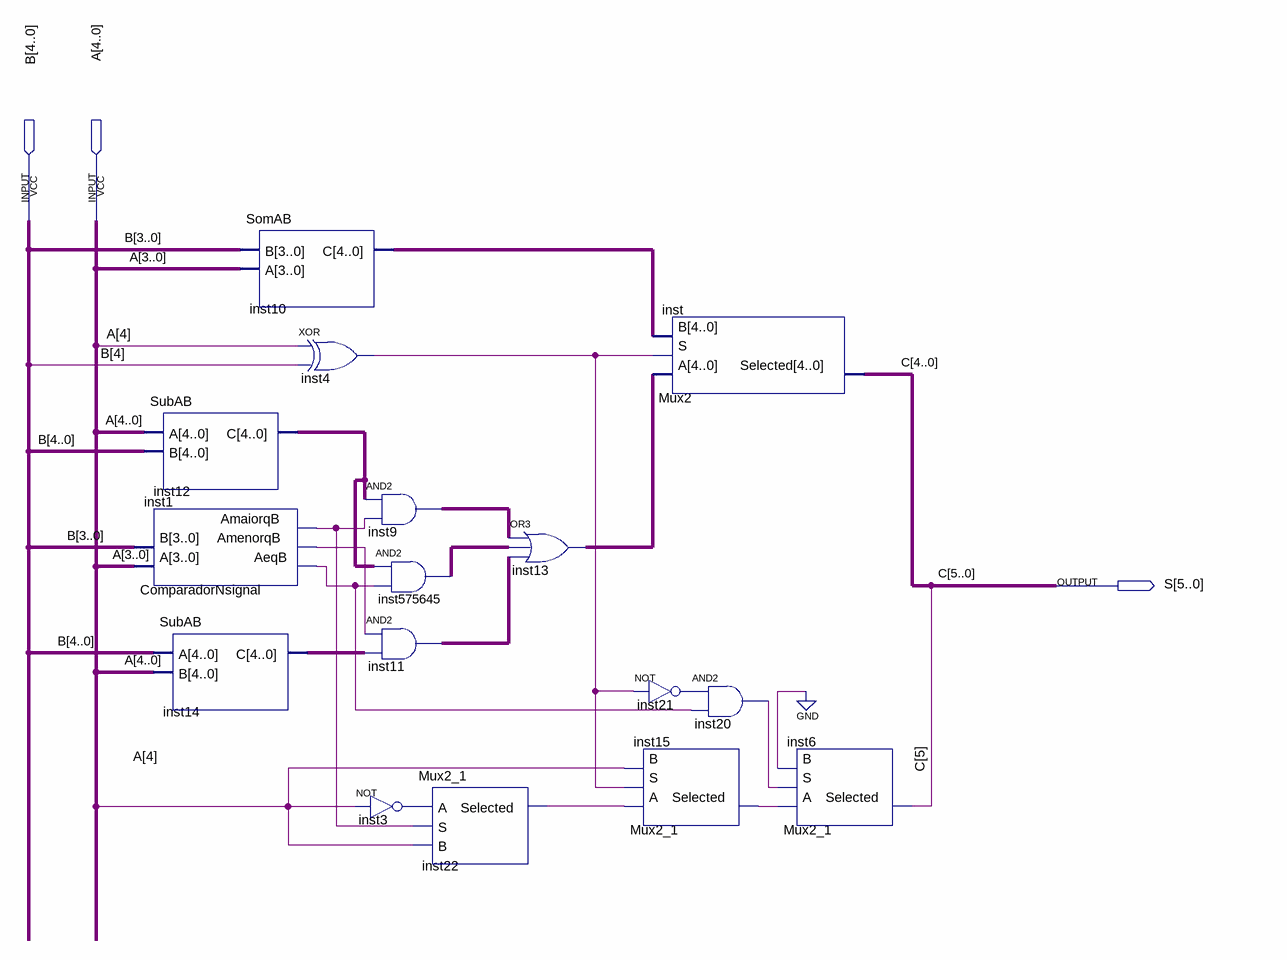
[diagram p0: schematic sheet]
// Quartus schematic Subtrator.bdf as structural Verilog: 16 symbols, 3 pins
module Subtrator (
  input  [4:0] B,
  input  [4:0] A,
  output [5:0] S
);

  wire inst1_aeqb, inst1_amaiorqb, inst1_amenorqb, inst3_out, inst4_out, inst15_selected, inst20_out,
       inst21_out, inst22_selected;
  wire [4:0] inst9_out, inst10_c, inst11_out, inst12_c, inst13_out, inst14_c, inst575645_out;

  ComparadorNsignal inst1 (
    .A(A[3:0]), .B(B[3:0]), .AeqB(inst1_aeqb), .AmenorqB(inst1_amenorqb), .AmaiorqB(inst1_amaiorqb));
  SubAB inst12 (.A(A), .B(B), .C(inst12_c));
  SubAB inst14 (.A(B), .B(A), .C(inst14_c));
  SomAB inst10 (.B(B[3:0]), .A(A[3:0]), .C(inst10_c));
  xor inst4 (inst4_out, A[4], B[4]);
  assign inst9_out = inst12_c & {5{inst1_amaiorqb}};  // AND2 inst9, 5 bits wide
  assign inst11_out = {5{inst1_amenorqb}} & inst14_c;  // AND2 inst11, 5 bits wide
  not inst3 (inst3_out, A[4]);
  assign inst575645_out = inst12_c & {5{inst1_aeqb}};  // AND2 inst575645, 5 bits wide
  Mux2_1 inst22 (.A(inst3_out), .S(inst1_amaiorqb), .B(A[4]), .Selected(inst22_selected));
  assign inst13_out = inst9_out | inst575645_out | inst11_out;  // OR3 inst13, 5 bits wide
  Mux2 inst (.A(inst13_out), .S(inst4_out), .B(inst10_c), .Selected(S[4:0]));
  not inst21 (inst21_out, inst4_out);
  Mux2_1 inst15 (.A(inst22_selected), .S(inst4_out), .B(A[4]), .Selected(inst15_selected));
  and inst20 (inst20_out, inst21_out, inst1_aeqb);
  Mux2_1 inst6 (.A(inst15_selected), .S(inst20_out), .B(1'b0), .Selected(S[5]));

  // Other names for the same wires on the sheet: C[5:0] = S
endmodule
